# Altium project Current_Sense_Tool.PrjPcb
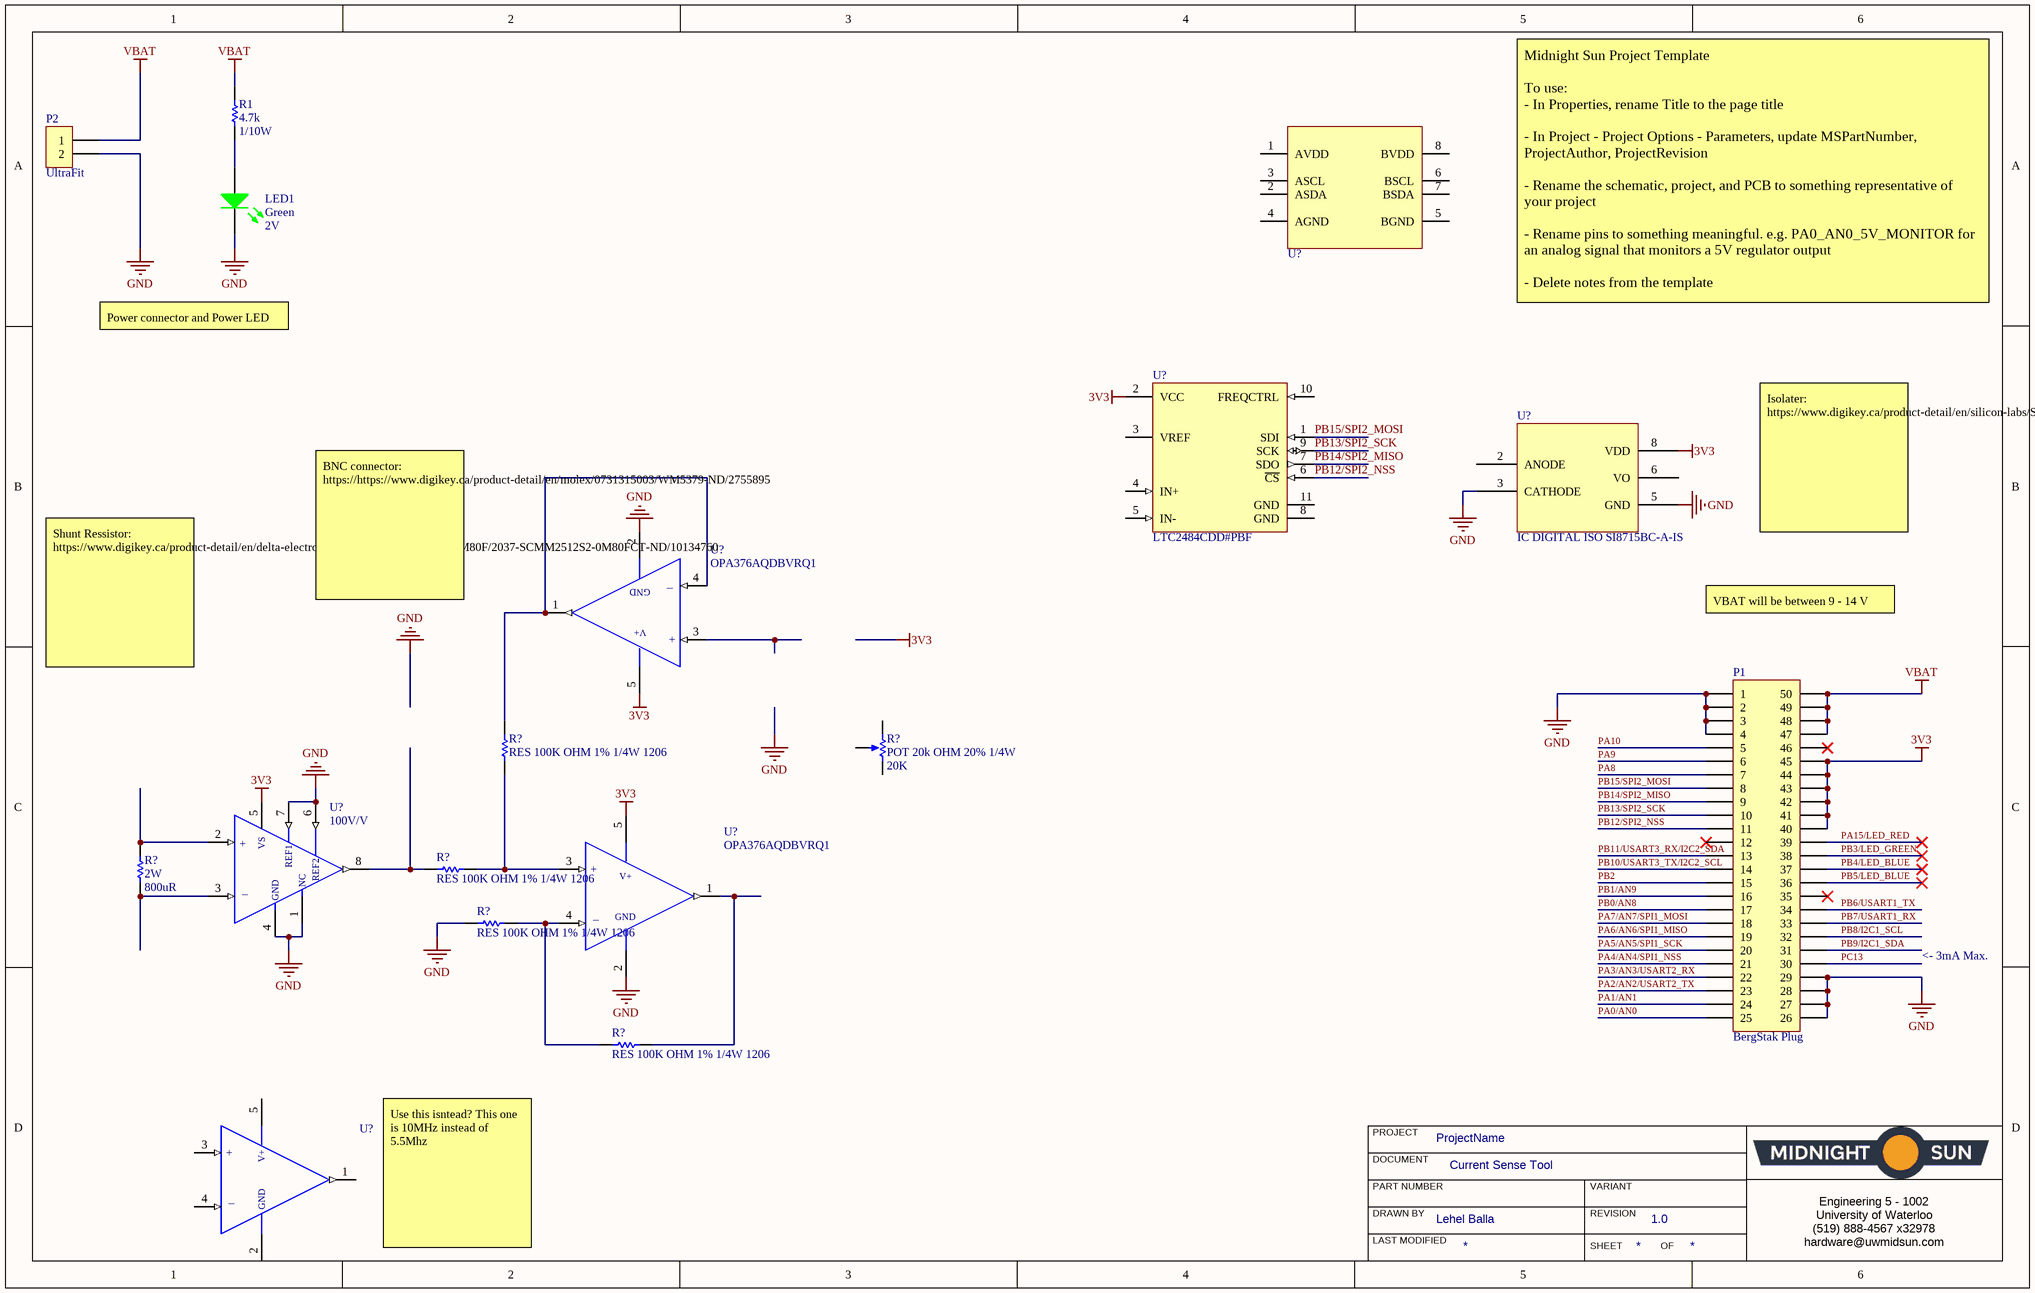
[diagram p0: Current_Sense_Tool_Controller_Board_Interface.SchDoc]
ProjectRevision: 1.0; ProjectAuthor: Lehel Balla
1 sheet, 17 parts. Net scope: global (net labels, ports and power ports of the same name join across sheets).
Board file: Current_Sense_Tool.PcbDoc

## Sheet Current_Sense_Tool_Controller_Board_Interface.SchDoc: Current Sense Tool
size B; Organization: Midnight Sun Solar Rayce Car Team; Address1: University of Waterloo; Address2: 200 University Ave W; Address3: Waterloo, ON, Canada; Address4: N2L 3E9; Website: www.uwmidsun.com; ProjectName: ProjectName

### Parts
(Parts that share a designator on the sheet are numbered #1, #2 ... from top to bottom, then left to right.)
LED1  Color: Green  Voltage - Forward (Vf) (Typ): 2V  [LED_0603]  (hidden comment: LED GREEN CLEAR 2V 0603)
P1  Series: BergStak Plug  [CONN, Bergstak 50 Pos Plug]  (hidden comment: CONN 50POS Bergstak Plug 0.02")
P2  Series: UltraFit  [CONN, 2POS ULTRA-FIT]  (hidden comment: CONN 2POS ULTRA-FIT 0.138")
R1  Resistance (Ohms): 4.7k  Power (Watts): 1/10W  [RES, 0603]  (hidden comment: RES 4.7K OHM 1% 1/10W 0603)
R?#1  POT 20k OHM 20% 1/4W  value 20K  [20K POT]
R?#2  RES 100K OHM 1% 1/4W 1206  [RES 1206]
R?#3  Max Power Dissipation: 2W  Ressistance: 800uR  [RES SMD 800 UOHM 1% 2W 2512]  (hidden comment: Ressistor)
R?#4  RES 100K OHM 1% 1/4W 1206  [RES 1206]
R?#5  RES 100K OHM 1% 1/4W 1206  [RES 1206]
R?#6  RES 100K OHM 1% 1/4W 1206  [RES 1206]
U?#1  IC DGTL ISO I2C 3.75KV 2CH 8SOIC  [IC DGTL ISO 3.75KV I2C 8SOIC NARROW BODY]  (value not drawn)
U?#2  Manufacturer Part Number 1: LTC2484CDD#PBF  [IC ADC LTC2484 10-DFN]  (hidden comment: IC ADC 24BIT 10-DFN)
U?#3  IC DIGITAL ISO SI8715BC-A-IS  [SOIC8]
U?#4  Manufacturer Part Number: OPA376AQDBVRQ1  [IC OP AMP GP RR 10MHZ SOT-23-5]  (hidden comment: IC OP AMP GEN PURPOSE RR 5.5MHZ SOT-23-5)
U?#5  100V/V  [IC CURRENT AMPLIFIER INA240 TSSOP-8]
U?#6  Manufacturer Part Number: OPA376AQDBVRQ1  [IC OP AMP GP RR 10MHZ SOT-23-5]  (hidden comment: IC OP AMP GEN PURPOSE RR 5.5MHZ SOT-23-5)
U?#7  IC OP AMP GEN PURPOSE RR 10MHZ SOT-23-5  [IC OP AMP GP RR 10MHZ SOT-23-5]  (value not drawn)

### Nets
3V3: P1.40 P1.41 P1.42 P1.43 P1.44 P1.45 U?#2.2(VCC) U?#3.8(VDD) U?#4.5(VDD) U?#5.5(VS) U?#6.5(VDD)
GND: LED1.2(K) P1.1 P1.2 P1.3 P1.4 P1.26 P1.27 P1.28 P1.29 P2.2 R?#5.1 U?#3.3(CATHODE) U?#3.5(GND) U?#4.2(VSS) U?#5.1(NC) U?#5.4(GND) U?#5.6(REF2) U?#5.7(REF1) U?#6.2(VSS)
VBAT: P1.47 P1.48 P1.49 P1.50 P2.1 R1.1
PA0/AN0: P1.25
PA1/AN1: P1.24
PA2/AN2/USART2_TX: P1.23
PA3/AN3/USART2_RX: P1.22
PA4/AN4/SPI1_NSS: P1.21
PA5/AN5/SPI1_SCK: P1.20
PA6/AN6/SPI1_MISO: P1.19
PA7/AN7/SPI1_MOSI: P1.18
PA8: P1.7
PA9: P1.6
PA10: P1.5
PA15/LED_RED: P1.39
PB0/AN8: P1.17
PB1/AN9: P1.16
PB2: P1.15
PB3/LED_GREEN: P1.38
PB4/LED_BLUE: P1.37
PB5/LED_BLUE: P1.36
PB6/USART1_TX: P1.34
PB7/USART1_RX: P1.33
PB8/I2C1_SCL: P1.32
PB9/I2C1_SDA: P1.31
PB10/USART3_TX/I2C2_SCL: P1.14
PB11/USART3_RX/I2C2_SDA: P1.13
PB12/SPI2_NSS: P1.11 U?#2.6(~{CS})
PB13/SPI2_SCK: P1.10 U?#2.9(SCK)
PB14/SPI2_MISO: P1.9 U?#2.7(SDO)
PB15/SPI2_MOSI: P1.8 U?#2.1(SDI)
PC13: P1.30
NetLED1_1: LED1.1(A) R1.2
NetR?#2_1: R?#2.1 U?#4.1(OUTPUT) U?#4.4(-IN)
NetR?#2_2: R?#2.2 R?#4.2 U?#6.3(+IN)
NetR?#3_1: R?#3.1 U?#5.2(+IN)
NetR?#3_2: R?#3.2 U?#5.3(-IN)
NetR?#4_1: R?#4.1 U?#5.8(OUTPUT)
NetR?#5_2: R?#5.2 R?#6.1 U?#6.4(-IN)
NetR?#6_2: R?#6.2 U?#6.1(OUTPUT)

Not connected (* = marked no-connect by the designer): P1 12* 35* 46*; R?#1 1(TOP) 2(TAP) 3(BOT); U?#1 1(AVDD) 2(ASDA) 3(ASCL) 4(AGND) 5(BGND) 6(BSCL) 7(BSDA) 8(BVDD); U?#2 3(VREF) 4(IN+) 5(IN-) 8(GND) 10(FREQCTRL) 11(GND); U?#3 2(ANODE) 6(VO); U?#4 3(+IN); U?#7 1(OUTPUT) 2(VSS) 3(+IN) 4(-IN) 5(VDD)

### Notes on the sheet
- Midnight Sun Project Template
  To use:
  - In Properties, rename Title to the page title
  - In Project - Project Options - Parameters, update MSPartNumber, ProjectAuthor, ProjectRevision
  - Rename the schematic, project, and PCB to something representative of your project
  - Rename pins to something meaningful. e.g. PA0_AN0_5V_MONITOR for an analog signal that monitors a 5V regulator output
  - Delete notes from the template
- Power connector and Power LED
- Isolater:
  https://www.digikey.ca/product-detail/en/silicon-labs/SI8641AB-B-IS1R/336-5212-1-ND/9175807
- BNC connector:
  https://https://www.digikey.ca/product-detail/en/molex/0731315003/WM5379-ND/2755895
- VBAT will be between 9 - 14 V
- Shunt Ressistor: https://www.digikey.ca/product-detail/en/delta-electronics-cyntec/SCMM2512S2-0M80F/2037-SCMM2512S2-0M80FCT-ND/10134760
- <- 3mA Max.
- Use this isntead? This one is 10MHz instead of 5.5Mhz
- PROJECT
- DOCUMENT
- DRAWN BY
- LAST MODIFIED
- PART NUMBER
- REVISION
- SHEET
- VARIANT
- OF
- Engineering 5 - 1002
  University of Waterloo
  (519) 888-4567 x32978
  hardware@uwmidsun.com
- (in symbol IC CURRENT AMPLIFIER INA240 8-TSSOP) +; _
- (in symbol IC OP AMP GEN PURPOSE RR 5.5MHZ SOT-23-5) +; V+; GND; _
- (in symbol IC OP AMP GEN PURPOSE RR 10MHZ SOT-23-5) V+; +; GND; _

### Library data of the parts
LED1 = LED GREEN CLEAR 2V 0603: Green 572nm LED Indication - Discrete 2V 0603 (1608 Metric); Manufacturer: Wurth Electronics Inc.; Manufacturer Part Number: 150060VS75000; Lens Color: Colorless; Millicandela Rating: 40mcd; Lens Style/Size: Rectangle with Flat Top, 1.10mm x 0.70mm; Current - Test: 20mA; Viewing Angle: 140°; Wavelength - Dominant: 570nm; Supplier 1: Digi-Key; RoHS: RoHS Compliant; Category: Optoelectronics; Stock 1: 9408; Pricing 1: 1=0.21, 100=0.1617, 500=0.13964 (CAD); Packaging: Cut Tape (CT); Part Status: Active; Lens Transparency: Clear; Mounting Type: Surface Mount; Wavelength - Peak: 572nm; Features: -; Package / Case: 0603 (1608 Metric); Supplier Device Package: 0603; Size / Dimension: 1.60mm L x 0.80mm W; Height (Max): 0.80mm; ComponentLink1URL: http://katalog.we-online.de/led/datasheet/150060VS75000.pdf; ComponentLink1Description: http://katalog.we-online.de/led/datasheet/150060VS75000.pdf; Supplier Part Number 1: 732-4980-1-ND
P1 = CONN 50POS Bergstak Plug 0.02": 50 Position Connector Plug, Outer Shroud Contacts Surface Mount Gold; Manufacturer 1: Amphenol FCI; Manufacturer Part Number 1: 10132797-055100LF; Number of Positions: 50; Mated Stacking Heights: 5mm; Pitch: 0.020" (0.50mm); Supplier 1: Digi-Key; Supplier Part Number 1: 609-5226-1-ND; Packaging: Cut Tape (CT); Part Status: Active; Connector Type: Plug, Outer Shroud Contacts; Number of Rows: 2; Mounting Type: Surface Mount; Contact Finish: Gold; Contact Finish Thickness: 1µin (0.025µm); Height Above Board: 0.169" (4.30mm); ComponentLink1URL: http://portal.fciconnect.com/Comergent//fci/drawing/10132797.pdf; ComponentLink1Description: http://portal.fciconnect.com/Comergent//fci/drawing/10132797.pdf
P2 = CONN 2POS ULTRA-FIT 0.138": Connector Header Through Hole 2 position 0.138" (3.50mm); Manufacturer: Molex; Manufacturer Part Number: 1722871102; Number of Positions: 2; Connector Type: Male Pin; Pitch: 0.138inch; ComponentLink1URL: http://www.molex.com/pdm_docs/sd/1722861302_sd.pdf; ComponentLink1Description: http://www.molex.com/pdm_docs/sd/1722861302_sd.pdf; Supplier 1: Digi-Key; RoHS: Yes; Stock 1: 2743; Pricing 1: 1 = 0.78000, 10 = 0.68800, 100 = 0.59380, 500 = 0.48582, 1000 = 0.43184, 5000 = 0.37786, 10000 = 0.35897 (USD); Mount: Through Hole; Color: Black; Contact Plating: Tin; Packaging: Tray; Number of Rows: 1; Termination: Solder; Fastening Type: Latch; Supplier Part Number 1: WM11701-ND
R1 = RES 4.7K OHM 1% 1/10W 0603: 4.7k Ohm ±1% 0.1W, 1/10W Chip Resistor 0603 (1608 Metric) Moisture Resistant Thick Film; Manufacturer 1: Yageo; Manufacturer Part Number 1: RC0603FR-074K7L; Description 1: RES SMD 4.7K OHM 1% 1/10W 0603; Temperature Coefficient: ±100ppm/°C; Supplier 1: Digi-Key; Supplier Part Number 1: 311-4.70KHRCT-ND; RoHS: RoHS Compliant; Category: Resistors; Stock 1: 3487566; Pricing 1: 1=0.16, 10=0.022, 100=0.0089, 1000=0.00402, 2500=0.00349 (CAD); Packaging: Cut Tape (CT); Part Status: Active; Composition: Thick Film; Features: Moisture Resistant; Operating Temperature: -55°C ~ 155°C; Package / Case: 0603 (1608 Metric); Supplier Device Package: 0603; Size / Dimension: 0.063" L x 0.031" W (1.60mm x 0.80mm); Height - Seated (Max): 0.022" (0.55mm); Failure Rate: -; ComponentLink1URL: http://www.yageo.com/documents/recent/PYu-RC_Group_51_RoHS_L_7.pdf; ComponentLink1Description: http://www.yageo.com/documents/recent/PYu-RC_Group_51_RoHS_L_7.pdf; Tolerance: ±1%
R?#1 = POT 20k OHM 20% 1/4W: 20k Ohm 0.25W, 1/4W Gull Wing Surface Mount Trimmer Potentiometer; Manufacture: TT Electronics/BI; Manufacture Part Number: 23BR20KLFTR; Adjustment Type: Top; Turns: 1; Power: 1/4W; Tolerence: 20%; Supplier 1: Digi-Key; Supplier Part Number 1: 987-1016-1-ND
R?#2 R?#4-R?#6 = RES 100K OHM 1% 1/4W 1206: 100 kOhms ±1% 0.25W, 1/4W Chip Resistor 1206 (3216 Metric) Moisture Resistant Thick Film; Manufacturer: Yageo; Manufacturer Part Number: RC1206FR-07100KL; Resistance: 100kR; Power Rating: 250mW; Temperature Coefficient: 100ppm/°C; Voltage Rating: 200V; Supplier 1: Digi-Key; Stock 1: 1498131; Pricing 1: 1=0.1, 10=0.033, 100=0.0136, 1000=0.0061, 2500=0.00529 (USD); Case/Package: 1206; Case Code (Imperial): 1206; Case Code (Metric): 3216; Min Operating Temperature: -55°C; Max Operating Temperature: 155°C; Tolerance: 1%; Packaging: Tape and Reel; Termination: SMD/SMT; Composition: Thick Film; Length: 3.1mm; Height: 0.55mm; Depth: 1.6mm; REACH SVHC: No SVHC; Lead Free: Lead Free; ComponentLink1URL: https://datasheet.ciiva.com/7857/444357-7857239.pdf; ComponentLink1Description: https://datasheet.ciiva.com/7857/444357-7857239.pdf; ComponentLink2URL: https://datasheet.ciiva.com/7857/444357-7857240.pdf; ComponentLink2Description: https://datasheet.ciiva.com/7857/444357-7857240.pdf; ComponentLink3URL: https://datasheet.ciiva.com/16997/pyu-rc1206-51-rohs-l-4-16997053.pdf; ComponentLink3Description: https://datasheet.ciiva.com/16997/pyu-rc1206-51-rohs-l-4-16997053.pdf; Supplier Part Number 1: 311-100KFRCT-ND
R?#3 = RES SMD 800 UOHM 1% 2W 2512: 800 µOhms ±1% 2W Chip Resistor 2512 (6432 Metric) Current Sense, Pulse Withstanding Metal Film; Manufacturer 1: Cyntec; Manufacturer Part Number 1: SCMM2512S2-0M80F; Supplier 1: Digi-Key; Supplier Part Number 1: 2037-SCMM2512S2-0M80FCT-ND; ComponentLink1Description: Datasheet; ComponentLink1URL: http://www.cyntec.com/upfile/products/download/CYNP-68-A13%20(A6)%20SCMM2512S2%20(0M30-R020).pdf; ComponentLink2Description: Digikey page; ComponentLink2URL: https://www.digikey.ca/product-detail/en/delta-electronics-cyntec/SCMM2512S2-0M80F/2037-SCMM2512S2-0M80FCT-ND/10134760; Stock 1: 4000; Pricing 1: 1=0.73000, 10=0.63200, 25=0.55520, 50=0.50720, 100=0.44020, 250=0.38280, 500=0.31772, 1000=0.25839 (USD)
U?#1 = IC DGTL ISO I2C 3.75KV 2CH 8SOIC: I²C Digital Isolator 3750Vrms 2 Channel 35kV/µs CMTI 8-SOIC (0.154", 3.90mm Width); Manufacturer 1: Silicon Labs; Manufacturer Part Number 1: SI8600AC-B-ISR; Number of Channels: 2; Data Rate: 10Mbps; Propagation Delay: 26ns; Channel Type: Bidirectional; Isolated Power: No; Pulse Width Distortion (PWD): 32ns; Supplier 1: Digi-Key; Supplier Part Number 1: SI8600AC-B-ISRCT-ND; Stock 1: 4033; Pricing 1: 1=3.33, 25=3.2084, 100=3.0849 (USD); Case/Package: SOIC; Number of Pins: 8; Weight: 0.006596oz; Min Operating Temperature: -40°C; Max Operating Temperature: 125°C; Package Quantity: 2500; Packaging: Tape and Reel; Polarity: Bidirectional; ComponentLink1URL: https://datasheet.ciiva.com/14921/supportdocuments2ftechnicaldocs2fsi860x-14921653.pdf; ComponentLink1Description: https://datasheet.ciiva.com/14921/supportdocuments2ftechnicaldocs2fsi860x-14921653.pdf
U?#2 = IC ADC 24BIT 10-DFN: 24 Bit Analog to Digital Converter 1 Input 1 Sigma-Delta 10-DFN (3x3); Manufacturer 1: Linear Technology; Number of Bits: 24; Sampling Rate (Per Second): 7.5; Number of Inputs: 1; Input Type: Differential; Data Interface: SPI; Configuration: MUX-ADC; Reference Type: External; Voltage - Supply, Analog: 2.7 V ~ 5.5 V; Supplier 1: Digi-Key; Supplier Part Number 1: LTC2484CDD#PBF-ND; Packaging: Tube; Part Status: Active; Ratio - S/H:ADC: -; Number of A/D Converters: 1; Architecture: Sigma-Delta; Voltage - Supply, Digital: 2.7 V ~ 5.5 V; Operating Temperature: 0°C ~ 70°C; Package / Case: 10-WFDFN Exposed Pad; Supplier Device Package: 10-DFN (3x3); ComponentLink1URL: http://www.linear.com/docs/7978; ComponentLink1Description: http://www.linear.com/docs/7978
U?#3 = IC DIGITAL ISO SI8715BC-A-IS: General Purpose Digital Isolator 3750Vrms 1 Channel 15Mbps 35kV/µs CMTI 8-SOIC (0.154", 3.90mm Width); Manufacturer: Silicon Labs; Isolated Power: No; Inputs - Side 1/Side 2: 1/0; Channel Type: Unidirectional; Propagation Delay tpLH / tpHL (Max): 50ns, 50ns; Pulse Width Distortion (Max): 25ns; Rise / Fall Time (Typ): 2.5ns, 2.5ns; Voltage - Supply: 2.5 V ~ 5.5 V; Manufacturer Part Number: SI8715BC-A-IS; RoHS: RoHS Compliant; Category: Isolators; Packaging: Tube; Part Status: Active; Technology: Capacitive Coupling; Type: General Purpose; Voltage - Isolation: 3750Vrms; Common Mode Transient Immunity (Min): 35kV/µs; Data Rate: 15Mbps; Operating Temperature: -40°C ~ 125°C; Package / Case: 8-SOIC (0.154", 3.90mm Width); Supplier Device Package: 8-SOIC; ComponentLink1URL: http://www.silabs.com/documents/public/data-sheets/Si871x-2x.pdf; ComponentLink1Description: http://www.silabs.com/documents/public/data-sheets/Si871x-2x.pdf; Supplier 1: Digi-Key; Stock 1: 497; Pricing 1: 1=1.45, 25=1.4016, 100=1.3478, 1000=1.33134 (CAD); Supplier Part Number 1: 336-3027-ND
U?#4 U?#6 = IC OP AMP GEN PURPOSE RR 5.5MHZ SOT-23-5: General Purpose Amplifier 1 Circuit Rail-to-Rail SOT-23-5; Manufacturer: Texas Instruments; Max Supply Voltage: 5.5V; Min Supply Voltage: 2.2V; Output Current: 30mA; Nominal Supply Current: 950uA; Voltage Gain: 134dB; Common Mode Rejection Ratio: 76dB; Number of Channels: 1; Slew Rate: 2V/µs; Max I/O Voltage: 25uV; Input Bias Current: 10pA; Operating Supply Current: 760uA; Output Current per Channel: 50mA; Power Supply Rejection Ratio (PSRR): 106.02dB; Supplier 1: Digi-Key; Stock 1: 26635; Pricing 1: 1 = 2.14000, 10 = 1.92200, 100 = 1.54450, 500 = 1.26896, 1000 = 1.05142 (USD); RoHS: Yes; Case/Package: SOT-23-5; Number of Pins: 5; Min Operating Temperature: -40°C; Max Operating Temperature: 125°C; Unity Gain Bandwidth Product: 5.5MHz; Packaging: Tape and Reel; Package Quantity: 3000; Number of Circuits: 1; Gain Bandwidth Product: 5.5MHz; Input Offset Voltage (Vos): 25uV; Number of Elements: 1; Radiation Hardening: No; Lead Free: Lead Free; ComponentLink1URL: http://www.ti.com/lit/ds/sbos549/sbos549.pdf?src-supplier=Avnet; ComponentLink1Description: http://www.ti.com/lit/ds/sbos549/sbos549.pdf?src-supplier=Avnet; Supplier Part Number 1: 296-36701-1-ND
U?#5 = IC CURRENT AMPLIFIER INA240 8-TSSOP: Current Sense Amplifier 1 Circuit 8-TSSOP; Manufacturer 1: Texas Instruments; Manufacturer Part Number 1: INA240A3PWR; Description 1: IC AMP CURRENT SENSE 8-TSSOP; Slew Rate: 2 V/µs; Current - Supply: 1.8mA; Voltage - Supply, Single/Dual (±): 2.7 V ~ 5.5 V; Supplier 1: Digi-Key; Supplier Part Number 1: 296-45090-1-ND; RoHS: RoHS Compliant; Category: Integrated Circuits (ICs); Stock 1: 1286; Pricing 1: 1=3.79, 10=3.397, 100=2.7311, 500=2.24388, 1000=1.85921 (CAD); Packaging: Cut Tape (CT); Part Status: Active; Amplifier Type: Current Sense; Output Type: -; Operating Temperature: -40°C ~ 125°C; Mounting Type: Surface Mount; Package / Case: 8-TSSOP (0.173", 4.40mm Width); Supplier Device Package: 8-TSSOP; ComponentLink1URL: http://www.ti.com/lit/ds/symlink/ina240.pdf; ComponentLink1Description: http://www.ti.com/lit/ds/symlink/ina240.pdf
U?#7 = IC OP AMP GEN PURPOSE RR 10MHZ SOT-23-5: General Purpose Amplifier 1 Circuit Rail-to-Rail SOT-23-5; Manufacturer 1: Texas Instruments; Manufacturer Part Number 1: TLV316QDBVRQ1; Description 1: IC OP AMP GP RR 10MHZ 5-SOT-23; Number of Circuits: 1; Slew Rate: 6 V/µs; Current - Supply: 400µA; Current - Output / Channel: 50mA; Voltage - Supply, Single/Dual (±): 1.8 V ~ 5.5 V, ±0.9 V ~ 2.75 V; Supplier 1: Digi-Key; Supplier Part Number 1: 296-45323-1-ND; RoHS: RoHS Compliant; Category: Integrated Circuits (ICs); Stock 1: 1747; Pricing 1: 1=1.33, 10=1.185, 100=0.9234, 500=0.76276, 1000=0.60218 (CAD); Packaging: Cut Tape (CT); Part Status: Active; Amplifier Type: General Purpose; Output Type: Rail-to-Rail; -3db Bandwidth: -; Operating Temperature: -40°C ~ 125°C; Mounting Type: Surface Mount; Package / Case: SC-74A, SOT-753; Supplier Device Package: SOT-23-5; ComponentLink1URL: http://www.ti.com/lit/ds/symlink/tlv316-q1.pdf; ComponentLink1Description: http://www.ti.com/lit/ds/symlink/tlv316-q1.pdf